# Altium schematic sheet PA stage 2.SchDoc
size A; SheetNumber: 9; SheetTotal: 12
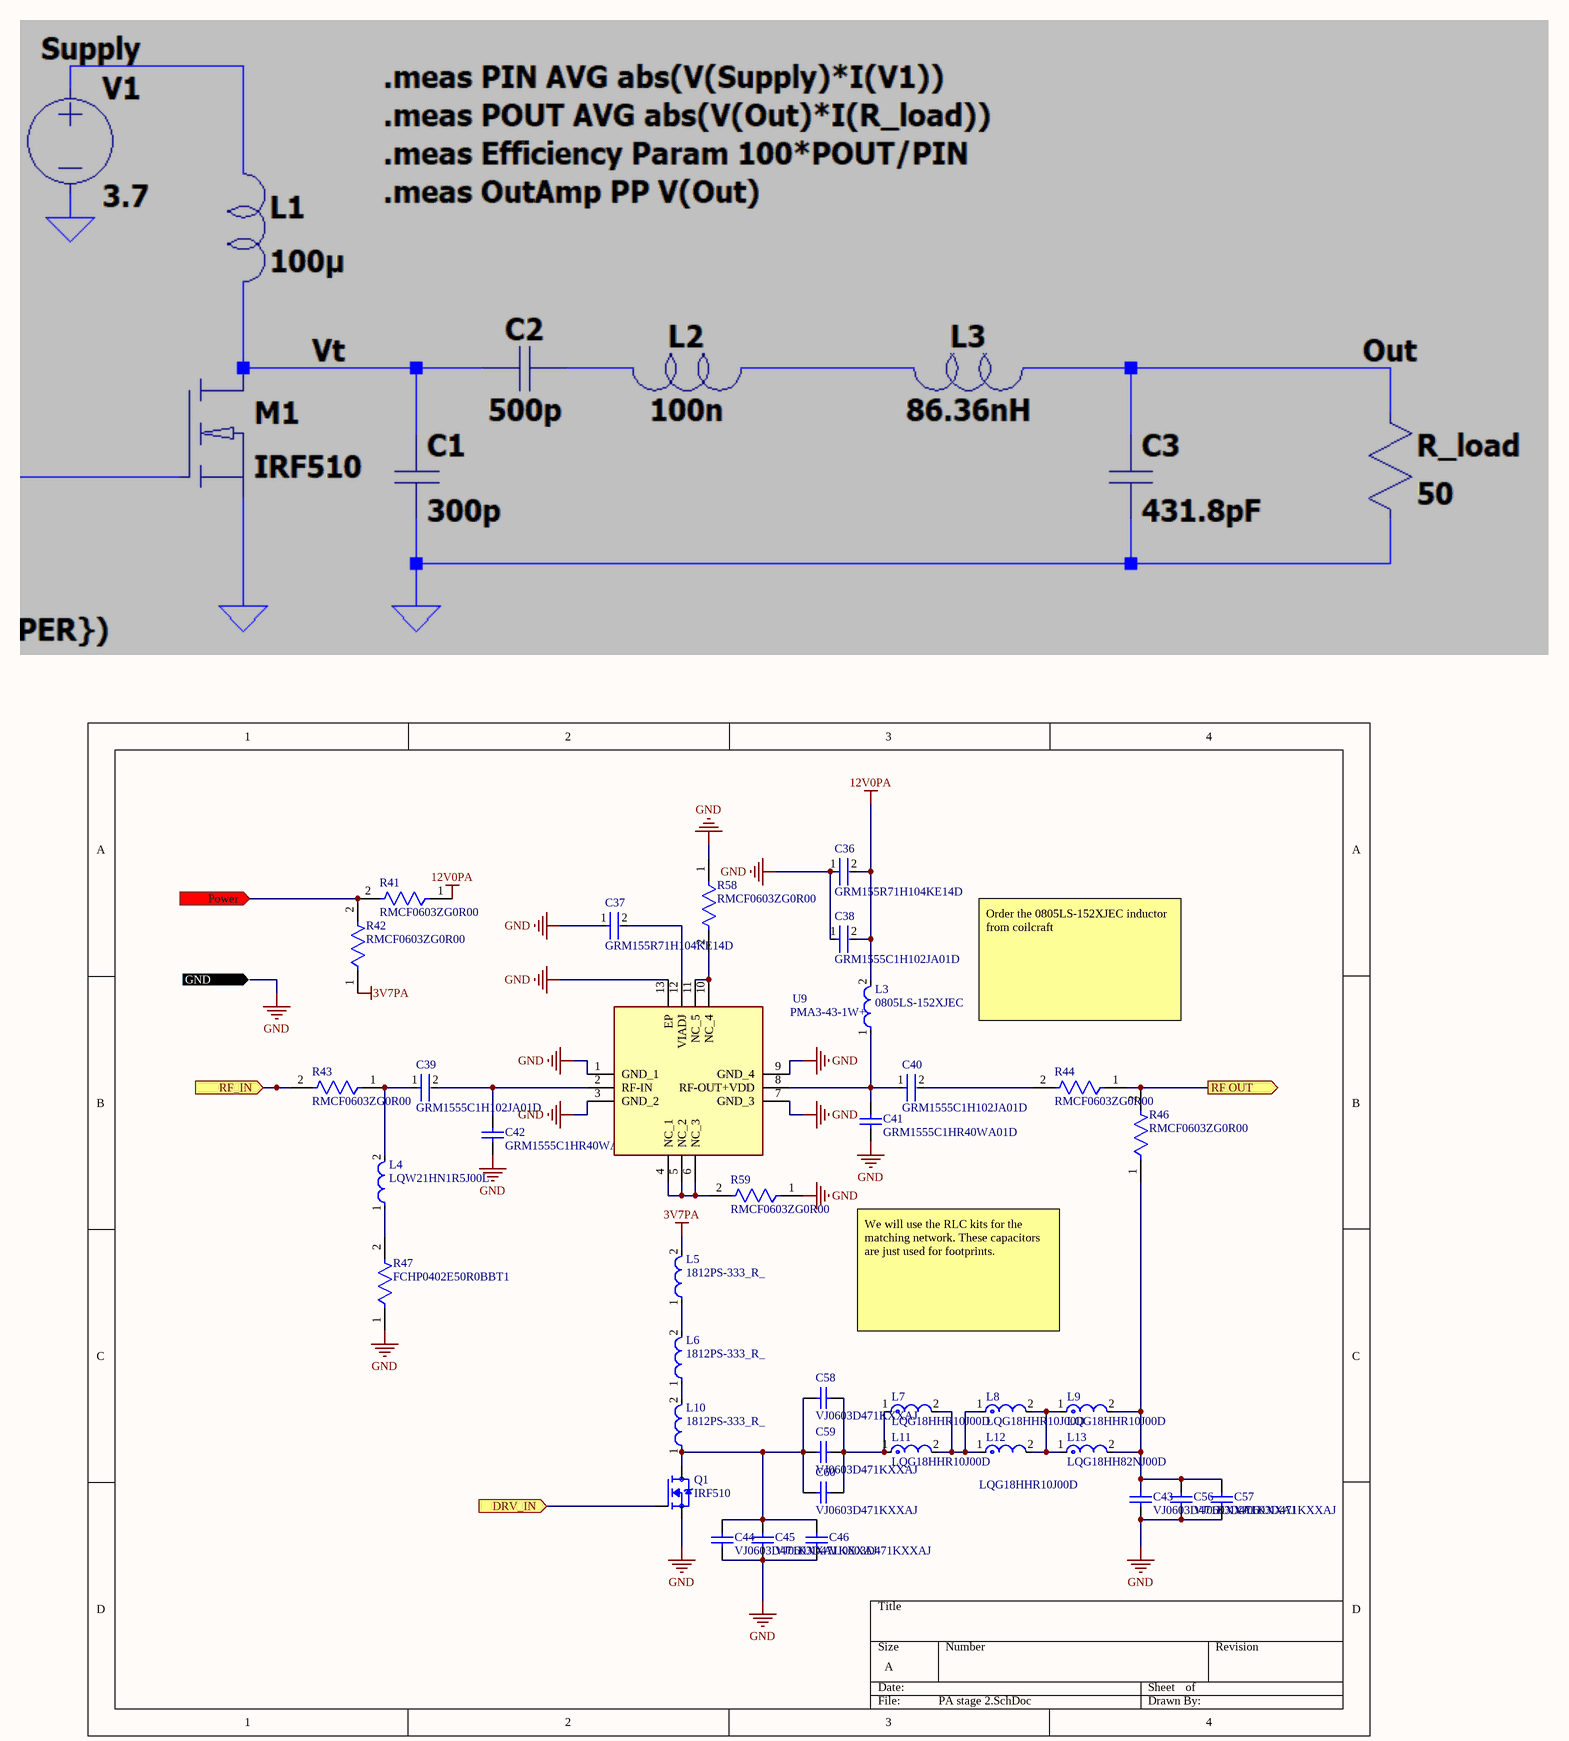
[diagram p0: PA stage 2.SchDoc]

## Parts
C36  GRM155R71H104KE14D  [FP-GRM155-0_05-IPC_B]
C37  GRM155R71H104KE14D  [FP-GRM155-0_05-IPC_B]
C38  GRM1555C1H102JA01D  [FP-GRM155-0_05-IPC_B]
C39  GRM1555C1H102JA01D  [FP-GRM155-0_05-IPC_B]
C40  GRM1555C1H102JA01D  [FP-GRM155-0_05-IPC_B]
C41  GRM1555C1HR40WA01D  [CAPC1005X55X25LL05T10]
C42  GRM1555C1HR40WA01D  [CAPC1005X55X25LL05T10]
C43  VJ0603D471KXXAJ  [CAPC1608X92X38LL15T08]
C44  VJ0603D471KXXAJ  [CAPC1608X92X38LL15T08]
C45  VJ0603D471KXXAJ  [CAPC1608X92X38LL15T08]
C46  VJ0603D471KXXAJ  [CAPC1608X92X38LL15T08]
C56  VJ0603D471KXXAJ  [CAPC1608X92X38LL15T08]
C57  VJ0603D471KXXAJ  [CAPC1608X92X38LL15T08]
C58  VJ0603D471KXXAJ  [CAPC1608X92X38LL15T08]
C59  VJ0603D471KXXAJ  [CAPC1608X92X38LL15T08]
C60  VJ0603D471KXXAJ  [CAPC1608X92X38LL15T08]
L3  0805LS-152XJEC  [FP-LQW21HN_00-MFG]
L4  LQW21HN1R5J00L  [FP-LQW21HN_00-MFG]
L5  1812PS-333_R_  [FP-1812PS-MFG]
L6  1812PS-333_R_  [FP-1812PS-MFG]
L7  LQG18HHR10J00D  [FP-LQG18HH_00-MFG]
L8  LQG18HHR10J00D  [FP-LQG18HH_00-MFG]
L9  LQG18HHR10J00D  [FP-LQG18HH_00-MFG]
L10  1812PS-333_R_  [FP-1812PS-MFG]
L11  LQG18HHR10J00D  [FP-LQG18HH_00-MFG]
L12  LQG18HHR10J00D  [FP-LQG18HH_00-MFG]
L13  LQG18HH82NJ00D  [FP-LQG18HH_00-IPC_B]
Q1  IRF510  [TO254P1051X465X1931-3]
R41  RMCF0603ZG0R00  [FP-RMCF0603-IPC_B]
R42  RMCF0603ZG0R00  [FP-RMCF0603-IPC_B]
R43  RMCF0603ZG0R00  [FP-RMCF0603-IPC_B]
R44  RMCF0603ZG0R00  [FP-RMCF0603-IPC_B]
R46  RMCF0603ZG0R00  [FP-RMCF0603-IPC_B]
R47  FCHP0402E50R0BBT1  [FP-FC0402-MFG]
R58  RMCF0603ZG0R00  [FP-RMCF0603-IPC_B]
R59  RMCF0603ZG0R00  [FP-RMCF0603-IPC_B]
U9  PMA3-43-1W+  [QFN51P300X300X89-13N]

## Ports
DRV_IN (in), GND (in), Power (in), RF OUT (out), RF_IN (in)

## Nets
3V7PA: L5.2 R42.1
12V0PA: C36.2 C38.2 L3.2 R41.1
GND: C36.1 C37.1 C38.1 C41.1 C42.1 C43.1 C44.1 C45.1 C46.1 C56.1 C57.1 Q1.3(S) R47.1 R58.1 R59.1 U9.1(GND_1) U9.3(GND_2) U9.7(GND_3) U9.9(GND_4) U9.13(EP) ; port GND
DRV_IN: Q1.1(G) ; port DRV_IN
Power: R41.2 R42.2 ; port Power
RF OUT: R44.1 R46.2 ; port RF OUT
RF_IN: R43.2 ; port RF_IN
NetC37_2: C37.2 U9.12(VIADJ)
NetC39_1: C39.1 L4.2 R43.1
NetC39_2: C39.2 C42.2 U9.2(RF-IN)
NetC40_1: C40.1 C41.2 L3.1 U9.8(RF-OUT+VDD)
NetC40_2: C40.2 R44.2
NetC43_2: C43.2 C56.2 C57.2 L9.2 L13.2 R46.1
NetC44_2: C44.2 C45.2 C46.2 C58.2 C59.2 C60.2 L10.1 Q1.2(D)
NetC58_1: C58.1 C59.1 C60.1 L7.1 L11.1
NetL4_1: L4.1 R47.2
NetL5_1: L5.1 L6.2
NetL6_1: L6.1 L10.2
NetL7_2: L7.2 L8.1 L11.2 L12.1
NetL8_2: L8.2 L9.1 L12.2 L13.1
NetR58_2: R58.2 U9.10(NC_4) U9.11(NC_5)
NetR59_2: R59.2 U9.4(NC_1) U9.5(NC_2) U9.6(NC_3)

## Notes on the sheet
- Order the 0805LS-152XJEC inductor from coilcraft
- We will use the RLC kits for the matching network. These capacitors are just used for footprints.

## Library data of the parts
C36 C37 = CMP-2008-04639-2: Chip Multilayer Ceramic Capacitors for General Purpose, 0402, 0.10uF, X7R, 15%, 10%, 50V; Dissipation Factor: 0.025%; Capacitance: 100nF; Weight: 0.000212oz; Thickness: 0.022inch; Voltage Rating (DC): 50V; Dielectric Material: Ceramic; Termination: SMD/SMT; Case/Package: 0402; Case Code (Imperial): 0402; Mount: Surface Mount; REACH SVHC: No SVHC; Resistor Type: Ceramic; Dielectric: X7R; Max Operating Temperature: 125°C; Voltage: 50V; Lead Free: Lead Free; Package Quantity: 10000; Packaging: Tape and Reel; Length: 1mm; Material: Ceramic; Height: 0.5mm; Depth: 0.5mm; Width: 0.5mm; Min Operating Temperature: -55°C; Tolerance: 10%; Case Code (Metric): 1005; Voltage Rating: 50V
C38-C40 = CMP-2008-04254-2: Chip Multilayer Ceramic Capacitors for General Purpose, 0402, 1000pF, C0G, 30ppm/°C, 5%, 50V; Insulation Resistance: 10GR; Capacitance: 1nF; Packaging: Tape and Reel; Lead Free: Lead Free; Tolerance: 5%; Temperature Coefficient: 30ppm/°C; Thickness: 0.022inch; Termination: SMD/SMT; Max Operating Temperature: 125°C; Height: 0.5mm; Package Quantity: 1; Radiation Hardening: No; Material: Ceramic; Case Code (Metric): 1005; Number of Pins: 2; Voltage Rating: 50V; Mount: Surface Mount; Voltage: 50V; Case/Package: 0402; Min Operating Temperature: -55°C; Dielectric Material: Ceramic; Width: 0.5mm; Depth: 0.5mm; Case Code (Imperial): 0402; REACH SVHC: No SVHC; Dielectric: C0G; Voltage Rating (DC): 50V; Length: 1mm
C41 C42 = CMP-1034-00010-2: Manufacturer: Murata; Part Number: GRM1555C1HR40WA01D
C43-C46 C56-C60 = CMP-2006-01521-1: Manufacturer: Vitramon; Part Number: VJ0603D471KXXAJ
L3 = CMP-06042-001639-1: 0805LS-152XJEC Coilcraft; Core Material: Ferrite; DC Current: 85mA; DC Resistance (DCR): 5.33R; Self Resonant Frequency: 350MHz; Shielding: Unshielded; Inductance: 1.5uH; Test Frequency: 10MHz; Tolerance: 5%; Q Factor: 35; Width: 0.047inch; Case Code (Metric): 2012; Current Rating: 85mA; Mount: Surface Mount; Max DC Current: 85mA; Length: 2mm; Height - Seated (Max): 0.039inch; Depth: 1.4mm; Min Operating Temperature: -40°C; Termination: SMD/SMT; Military Standard: Not; Radiation Hardening: No; Packaging: Tape and Reel; Resistor Type: Wirewound; Case/Package: 0805; Case Code (Imperial): 0805; Weight: 0.000282oz; Height: 0.9mm; Package Quantity: 3000; Max Operating Temperature: 85°C
L4 = CMP-06042-001639-1: Wire Wound Ferrite type RF Inuctor 1.5uH ±5% 85mA 5.33Ω 0805 (2012); DC Resistance (DCR): 5.33R; Self Resonant Frequency: 350MHz; Shielding: Unshielded; Test Frequency: 10MHz; Q Factor: 35; Width: 0.047inch; Core Material: Ferrite; Case Code (Metric): 2012; DC Current: 85mA; Current Rating: 85mA; Mount: Surface Mount; Max DC Current: 85mA; Length: 2mm; Height - Seated (Max): 0.039inch; Depth: 1.4mm; Min Operating Temperature: -40°C; Termination: SMD/SMT; Military Standard: Not; Radiation Hardening: No; Packaging: Tape and Reel; Resistor Type: Wirewound; Case/Package: 0805; Case Code (Imperial): 0805; Inductance: 1.5uH; Weight: 0.000282oz; Height: 0.9mm; Package Quantity: 3000; Max Operating Temperature: 85°C; Tolerance: 5%
L5 L6 = CMP-11268-000188-1: 1812PS-333_R_Coilcraft; Core Material: Ferrite; Test Frequency: 100kHz; DC Resistance (DCR): 170mR; Inductance: 10uH; Self Resonant Frequency: 120MHz; Q Factor: 40; Shielding: Shielded; Tolerance: 5%; Max DC Current: 1.7A; Height: 3.81mm; Length: 5.87mm; Case/Package: 1812; Series: 1812PS; Packaging: Tape and Reel; Package Quantity: 600; Width: 4.98mm; Max Operating Temperature: 105°C; Termination: SMD/SMT; Lead Free: Contains Lead; Min Operating Temperature: -40°C; RoHS Compliant: Yes
L7-L9 L11 L12 = CMP-06042-004589-1: Multilayer type Inductor for Automotive 100nH ±5% 0.9Ω 300mA 0603; DC Resistance (DCR): 4.18mR; Termination: SMD/SMT; Package Quantity: 4000; Inductance: 100nH; Case/Package: 0603; Packaging: Tape and Reel
L10 = CMP-11268-000188-1: 1812PS-333_R_ Coilcraft; Core Material: Ferrite; Test Frequency: 100kHz; DC Resistance (DCR): 170mR; Inductance: 10uH; Self Resonant Frequency: 120MHz; Q Factor: 40; Shielding: Shielded; Tolerance: 5%; Max DC Current: 1.7A; Height: 3.81mm; Length: 5.87mm; Case/Package: 1812; Series: 1812PS; Packaging: Tape and Reel; Package Quantity: 600; Width: 4.98mm; Max Operating Temperature: 105°C; Termination: SMD/SMT; Lead Free: Contains Lead; Min Operating Temperature: -40°C; RoHS Compliant: Yes
L13 = CMP-06042-003651-1: Multilayer type Inductor for Automotive 82nH ±5% 0.85Ω 300mA 0603; DC Resistance (DCR): 4.18mR; Case/Package: 0603; Termination: SMD/SMT; Packaging: Tape and Reel; Inductance: 82nH; Package Quantity: 4000
Q1 = IRF510: N-Channel 100 V 5.6A (Tc) 3.7W (Ta), 43W (Tc) Surface Mount DÂ²PAK (TO-263); MF: Vishay Siliconix; SnapEDA_Link: https://www.snapeda.com/parts/IRF510/Vishay+Siliconix/view-part/?ref=snap; Package: TO-220-3 Vishay; Value: *; MP: IRF510; Check_prices: https://www.snapeda.com/parts/IRF510/Vishay+Siliconix/view-part/?ref=eda
R41-R44 R46 R58 R59 = CMP-26527-006412-1: 0Ω ±0 0.1W 0603 Thick Film Chip Resistor AEC-Q200 compliant; Max Power Dissipation: 100mW; Resistance: 0R; Width: 0.031inch; RoHS Compliant: Yes; Number of Terminations: 2; Case/Package: 0603; Contact Plating: Tin; Height: 0.022inch; Resistor Type: Thick Film; Mount: Surface Mount; Length: 0.061inch; Features: Automotive AEC-Q200; Series: RMCF; Max Operating Temperature: 155°C; Radiation Hardening: No; Min Operating Temperature: -55°C; Packaging: Tape and Reel
R47 = CMP-05494-120702529-1: FCHP0402E50R0BBT1 SMD Chip Resistor, 50 Ohm, ± 0.1%, 1 W, 0402 [1005 Metric], Thin Film, High Frequency; Power Rating: 1W; Voltage Rating: 30V; Temperature Coefficient: 25ppm/°C; Resistance: 50Ω; Max Operating Temperature: 155°C; Min Operating Temperature: -55°C; Composition: Thin Film; Schedule B: 8533210045; Case/Package: 0402; Tolerance: 0.1%; Height: 419.1µm; NexarPartId: 120702529
U9 = PMA3-43-1W+: Integrated Circuit; Manufacturer_Name: Mini-Circuits; Datasheet Link: https://www.minicircuits.com/pdfs/PMA3-43-1W+.pdf; Height: 0.89mm; Manufacturer_Part_Number: PMA3-43-1W+